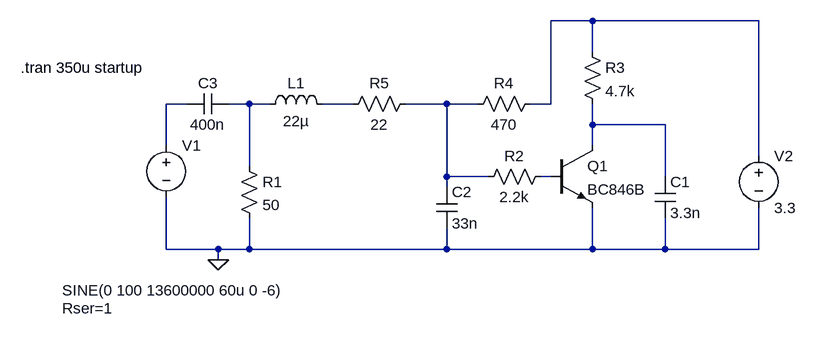
[diagram p0: schematic tip_detector.asc]
tip_detector.asc, the LTspice schematic file:
Version 4
SHEET 1 880 680
WIRE 320 -96 256 -96
WIRE 576 -96 320 -96
WIRE 320 -48 320 -96
WIRE -304 32 -336 32
WIRE -208 32 -240 32
WIRE -176 32 -208 32
WIRE -48 32 -96 32
WIRE 96 32 32 32
WIRE 144 32 96 32
WIRE 256 32 256 -96
WIRE 256 32 224 32
WIRE 320 64 320 32
WIRE 432 64 320 64
WIRE -336 96 -336 32
WIRE 320 96 320 64
WIRE 576 112 576 -96
WIRE -208 128 -208 32
WIRE 96 144 96 32
WIRE 160 144 96 144
WIRE 256 144 240 144
WIRE 432 144 432 64
WIRE 96 160 96 144
WIRE -336 256 -336 176
WIRE -256 256 -336 256
WIRE -208 256 -208 208
WIRE -208 256 -256 256
WIRE 96 256 96 224
WIRE 96 256 -208 256
WIRE 320 256 320 192
WIRE 320 256 96 256
WIRE 432 256 432 208
WIRE 432 256 320 256
WIRE 576 256 576 192
WIRE 576 256 432 256
WIRE -256 272 -256 256
FLAG -256 272 0
SYMBOL res -224 112 R0
SYMATTR InstName R1
SYMATTR Value 50
SYMBOL voltage -336 80 R0
WINDOW 3 -160 239 Left 2
WINDOW 123 0 0 Left 2
WINDOW 39 -160 267 Left 2
SYMATTR Value SINE(0 100 13600000 60u 0 -6)
SYMATTR SpiceLine Rser=1
SYMATTR InstName V1
SYMBOL npn 256 96 R0
SYMATTR InstName Q1
SYMATTR Value BC846B
SYMBOL res 256 128 R90
WINDOW 0 0 56 VBottom 2
WINDOW 3 32 56 VTop 2
SYMATTR InstName R2
SYMATTR Value 2.2k
SYMBOL res 304 -64 R0
SYMATTR InstName R3
SYMATTR Value 4.7k
SYMBOL cap 416 144 R0
SYMATTR InstName C1
SYMATTR Value 3.3n
SYMBOL ind -192 48 R270
WINDOW 0 32 56 VTop 2
WINDOW 3 5 56 VBottom 2
SYMATTR InstName L1
SYMATTR Value 22µ
SYMBOL cap 80 160 R0
SYMATTR InstName C2
SYMATTR Value 33n
SYMBOL res 240 16 R90
WINDOW 0 0 56 VBottom 2
WINDOW 3 32 56 VTop 2
SYMATTR InstName R4
SYMATTR Value 470
SYMBOL voltage 576 96 R0
WINDOW 123 0 0 Left 2
WINDOW 39 0 0 Left 2
SYMATTR InstName V2
SYMATTR Value 3.3
SYMBOL cap -240 16 R90
WINDOW 0 0 32 VBottom 2
WINDOW 3 32 32 VTop 2
SYMATTR InstName C3
SYMATTR Value 400n
SYMBOL res 48 16 R90
WINDOW 0 0 56 VBottom 2
WINDOW 3 32 56 VTop 2
SYMATTR InstName R5
SYMATTR Value 22
TEXT -560 -24 Left 2 !.tran 350u startup

The netlist it stands for:
* tip_detector.asc
R1 N003 0 50
V1 N002 0 SINE(0 100 13600000 60u 0 -6) Rser=1
Q1 N006 N007 0 0 BC846B
R2 N007 N005 2.2k
R3 N001 N006 4.7k
C1 N006 0 3.3n
L1 N003 N004 22µ
C2 N005 0 33n
R4 N001 N005 470
V2 N001 0 3.3
C3 N003 N002 400n
R5 N005 N004 22
.model NPN NPN
.model PNP PNP
.lib standard.bjt
.tran 350u startup
.backanno
.end